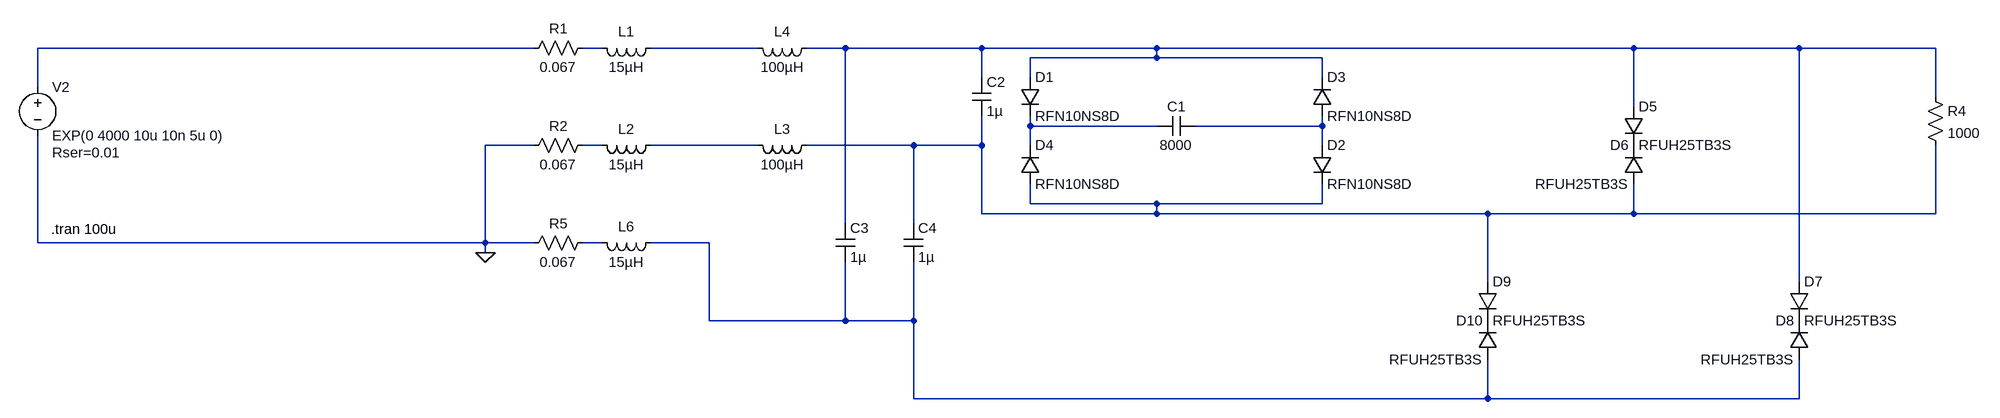
[diagram p0: schematic Draft2.asc]
Draft2.asc, the LTspice schematic file:
Version 4
SHEET 1 2212 680
WIRE -176 64 -992 64
WIRE -64 64 -96 64
WIRE 192 64 16 64
WIRE 336 64 272 64
WIRE 560 64 336 64
WIRE 848 64 560 64
WIRE 1632 64 848 64
WIRE 1904 64 1632 64
WIRE 2128 64 1904 64
WIRE 848 80 848 64
WIRE 848 80 640 80
WIRE 1120 80 848 80
WIRE 560 112 560 64
WIRE 640 112 640 80
WIRE 1120 112 1120 80
WIRE -992 128 -992 64
WIRE 2128 144 2128 64
WIRE 1632 160 1632 64
WIRE 640 192 640 176
WIRE 848 192 640 192
WIRE 1120 192 1120 176
WIRE 1120 192 912 192
WIRE -176 224 -256 224
WIRE -64 224 -96 224
WIRE 192 224 16 224
WIRE 448 224 272 224
WIRE 560 224 560 176
WIRE 560 224 448 224
WIRE 640 224 640 192
WIRE 1120 224 1120 192
WIRE 640 320 640 288
WIRE 848 320 640 320
WIRE 1120 320 1120 288
WIRE 1120 320 848 320
WIRE 560 336 560 224
WIRE 848 336 848 320
WIRE 848 336 560 336
WIRE 1392 336 848 336
WIRE 1632 336 1632 288
WIRE 1632 336 1392 336
WIRE 2128 336 2128 224
WIRE 2128 336 1632 336
WIRE 336 352 336 64
WIRE 448 352 448 224
WIRE -992 384 -992 208
WIRE -256 384 -256 224
WIRE -256 384 -992 384
WIRE -176 384 -256 384
WIRE -64 384 -96 384
WIRE 112 384 16 384
WIRE -256 400 -256 384
WIRE 1392 448 1392 336
WIRE 1904 448 1904 64
WIRE 112 512 112 384
WIRE 336 512 336 416
WIRE 336 512 112 512
WIRE 448 512 448 416
WIRE 448 512 336 512
WIRE 448 640 448 512
WIRE 1392 640 1392 576
WIRE 1392 640 448 640
WIRE 1904 640 1904 576
WIRE 1904 640 1392 640
FLAG -256 400 0
SYMBOL ind 32 48 R90
WINDOW 0 5 56 VBottom 2
WINDOW 3 32 56 VTop 2
SYMATTR InstName L1
SYMATTR Value 15µH
SYMBOL ind 32 208 R90
WINDOW 0 5 56 VBottom 2
WINDOW 3 32 56 VTop 2
SYMATTR InstName L2
SYMATTR Value 15µH
SYMBOL res -80 48 R90
WINDOW 0 0 56 VBottom 2
WINDOW 3 32 56 VTop 2
SYMATTR InstName R1
SYMATTR Value 0.067
SYMBOL res -80 208 R90
WINDOW 0 0 56 VBottom 2
WINDOW 3 32 56 VTop 2
SYMATTR InstName R2
SYMATTR Value 0.067
SYMBOL voltage -992 112 R0
WINDOW 123 0 0 Left 0
WINDOW 39 24 124 Left 2
SYMATTR InstName V2
SYMATTR Value EXP(0 4000 10u 10n 5u 0)
SYMATTR SpiceLine Rser=0.01
SYMBOL ind 176 48 M90
WINDOW 0 5 56 VBottom 2
WINDOW 3 32 56 VTop 2
SYMATTR InstName L4
SYMATTR Value 100µH
SYMATTR SpiceLine Ipk=15 Rser=0.2
SYMBOL diode 624 112 R0
SYMATTR InstName D1
SYMATTR Value RFN10NS8D
SYMBOL cap 912 176 R90
WINDOW 0 0 32 VBottom 2
WINDOW 3 32 32 VTop 2
SYMATTR InstName C1
SYMATTR Value 8000
SYMATTR SpiceLine V=630 Rser=0.01 Lser=100n Rpar=190k
SYMBOL diode 1104 224 R0
SYMATTR InstName D2
SYMATTR Value RFN10NS8D
SYMBOL diode 1104 176 M180
WINDOW 0 24 64 Left 2
WINDOW 3 24 0 Left 2
SYMATTR InstName D3
SYMATTR Value RFN10NS8D
SYMBOL diode 624 288 M180
WINDOW 0 24 64 Left 2
WINDOW 3 24 0 Left 2
SYMATTR InstName D4
SYMATTR Value RFN10NS8D
SYMBOL ind 176 208 M90
WINDOW 0 5 56 VBottom 2
WINDOW 3 32 56 VTop 2
SYMATTR InstName L3
SYMATTR Value 100µH
SYMATTR SpiceLine Ipk=15 Rser=0.2
SYMBOL cap 544 112 R0
SYMATTR InstName C2
SYMATTR Value 1µ
SYMATTR SpiceLine V=1000 Rser=0.01
SYMBOL ind 32 368 R90
WINDOW 0 5 56 VBottom 2
WINDOW 3 32 56 VTop 2
SYMATTR InstName L6
SYMATTR Value 15µH
SYMBOL res -80 368 R90
WINDOW 0 0 56 VBottom 2
WINDOW 3 32 56 VTop 2
SYMATTR InstName R5
SYMATTR Value 0.067
SYMBOL cap 320 352 R0
SYMATTR InstName C3
SYMATTR Value 1µ
SYMATTR SpiceLine V=1000 Rser=0.01
SYMBOL cap 432 352 R0
SYMATTR InstName C4
SYMATTR Value 1µ
SYMATTR SpiceLine V=1000 Rser=0.01
SYMBOL res 2112 128 R0
SYMATTR InstName R4
SYMATTR Value 1000
SYMBOL diode 1616 160 R0
SYMATTR InstName D5
SYMATTR Value RFUH25TB3S
SYMATTR Description Zener Diode
SYMATTR Type zener
SYMBOL diode 1648 288 R180
WINDOW 0 24 64 Left 2
WINDOW 3 24 0 Left 2
SYMATTR InstName D6
SYMATTR Value RFUH25TB3S
SYMATTR Description Zener Diode
SYMATTR Type zener
SYMBOL diode 1888 448 R0
SYMATTR InstName D7
SYMATTR Value RFUH25TB3S
SYMATTR Description Zener Diode
SYMATTR Type zener
SYMBOL diode 1920 576 R180
WINDOW 0 24 64 Left 2
WINDOW 3 24 0 Left 2
SYMATTR InstName D8
SYMATTR Value RFUH25TB3S
SYMATTR Description Zener Diode
SYMATTR Type zener
SYMBOL diode 1376 448 R0
SYMATTR InstName D9
SYMATTR Value RFUH25TB3S
SYMATTR Description Zener Diode
SYMATTR Type zener
SYMBOL diode 1408 576 R180
WINDOW 0 24 64 Left 2
WINDOW 3 24 0 Left 2
SYMATTR InstName D10
SYMATTR Value RFUH25TB3S
SYMATTR Description Zener Diode
SYMATTR Type zener
TEXT -970 362 Left 2 !.tran 100u

The netlist it stands for:
* Draft2.asc
L1 N003 N002 15µH
L2 N008 N007 15µH
R1 N002 N001 0.067
R2 N007 0 0.067
V2 N001 0 EXP(0 4000 10u 10n 5u 0) Rser=0.01
L4 N003 N004 100µH Ipk=15 Rser=0.2
D1 N004 N005 RFN10NS8D
C1 N006 N005 8000 V=630 Rser=0.01 Lser=100n Rpar=190k
D2 N006 N009 RFN10NS8D
D3 N006 N004 RFN10NS8D
D4 N009 N005 RFN10NS8D
L3 N008 N009 100µH Ipk=15 Rser=0.2
C2 N004 N009 1µ V=1000 Rser=0.01
L6 N011 N010 15µH
R5 N010 0 0.067
C3 N004 N011 1µ V=1000 Rser=0.01
C4 N009 N011 1µ V=1000 Rser=0.01
R4 N004 N009 1000
D5 N004 P001 RFUH25TB3S
D6 N009 P001 RFUH25TB3S
D7 N004 P002 RFUH25TB3S
D8 N011 P002 RFUH25TB3S
D9 N009 P003 RFUH25TB3S
D10 N011 P003 RFUH25TB3S
.model D D
.lib standard.dio
.tran 100u
.backanno
.end